# Altium schematic sheet Main.SchDoc
size A4; SheetNumber: 2; SheetTotal: 5
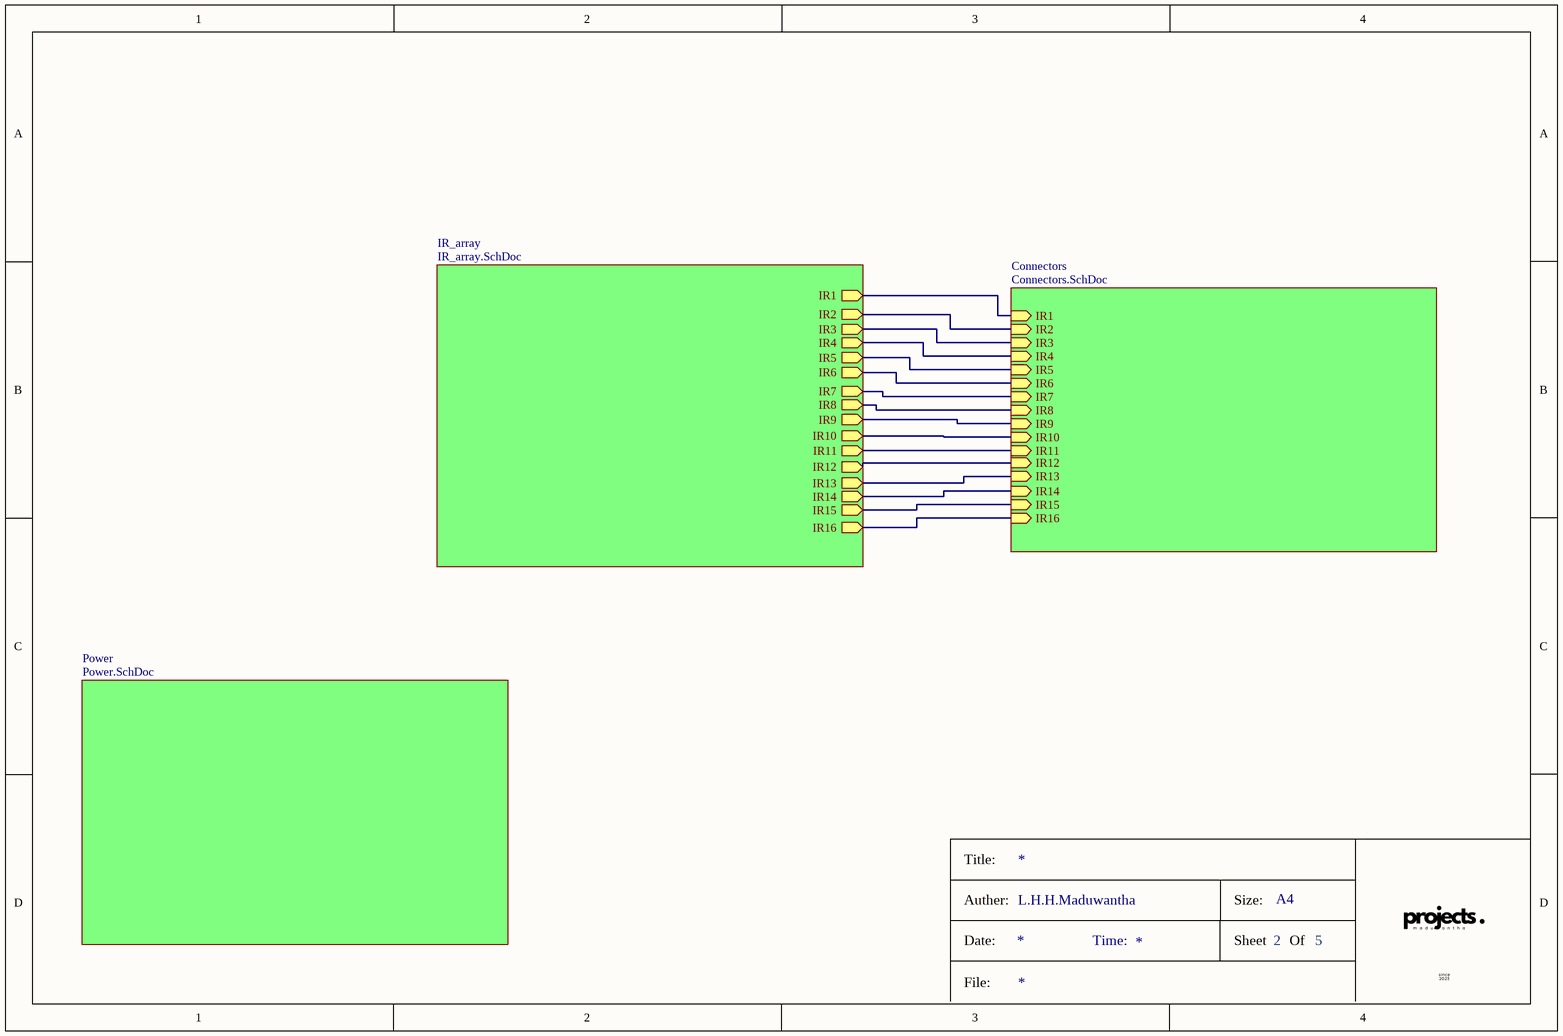
[diagram p0: Main.SchDoc]

## Sub-sheets
Connectors = Connectors.SchDoc: IR1 (in), IR2 (in), IR3 (in), IR5 (in), IR4 (in), IR6 (in), IR7 (in), IR8 (in), IR9 (in), IR10 (in), IR11 (in), IR13 (in), IR12 (in), IR14 (in), IR15 (in), IR16 (in)
IR_array = IR_array.SchDoc: IR1 (out), IR2 (out), IR3 (out), IR4 (out), IR8 (out), IR7 (out), IR11 (out), IR12 (out), IR16 (out), IR15 (out), IR5 (out), IR9 (out), IR13 (out), IR14 (out), IR6 (out), IR10 (out)
Power = Power.SchDoc: no entries

## Nets
(unnamed): sheet IR_array/IR1, sheet Connectors/IR1
(unnamed): sheet IR_array/IR2, sheet Connectors/IR2
(unnamed): sheet IR_array/IR3, sheet Connectors/IR3
(unnamed): sheet IR_array/IR4, sheet Connectors/IR4
(unnamed): sheet IR_array/IR8, sheet Connectors/IR8
(unnamed): sheet IR_array/IR7, sheet Connectors/IR7
(unnamed): sheet IR_array/IR11, sheet Connectors/IR11
(unnamed): sheet IR_array/IR12, sheet Connectors/IR12
(unnamed): sheet IR_array/IR16, sheet Connectors/IR16
(unnamed): sheet IR_array/IR15, sheet Connectors/IR15
(unnamed): sheet IR_array/IR5, sheet Connectors/IR5
(unnamed): sheet IR_array/IR9, sheet Connectors/IR9
(unnamed): sheet IR_array/IR13, sheet Connectors/IR13
(unnamed): sheet IR_array/IR14, sheet Connectors/IR14
(unnamed): sheet IR_array/IR6, sheet Connectors/IR6
(unnamed): sheet IR_array/IR10, sheet Connectors/IR10

## Notes on the sheet
- Title:
- Auther:
- L.H.H.Maduwantha
- Size:
- A4
- Date:
- File:
- Time:
- Sheet
- Of